# EAGLE design gps-power (EAGLE 9.6.2)
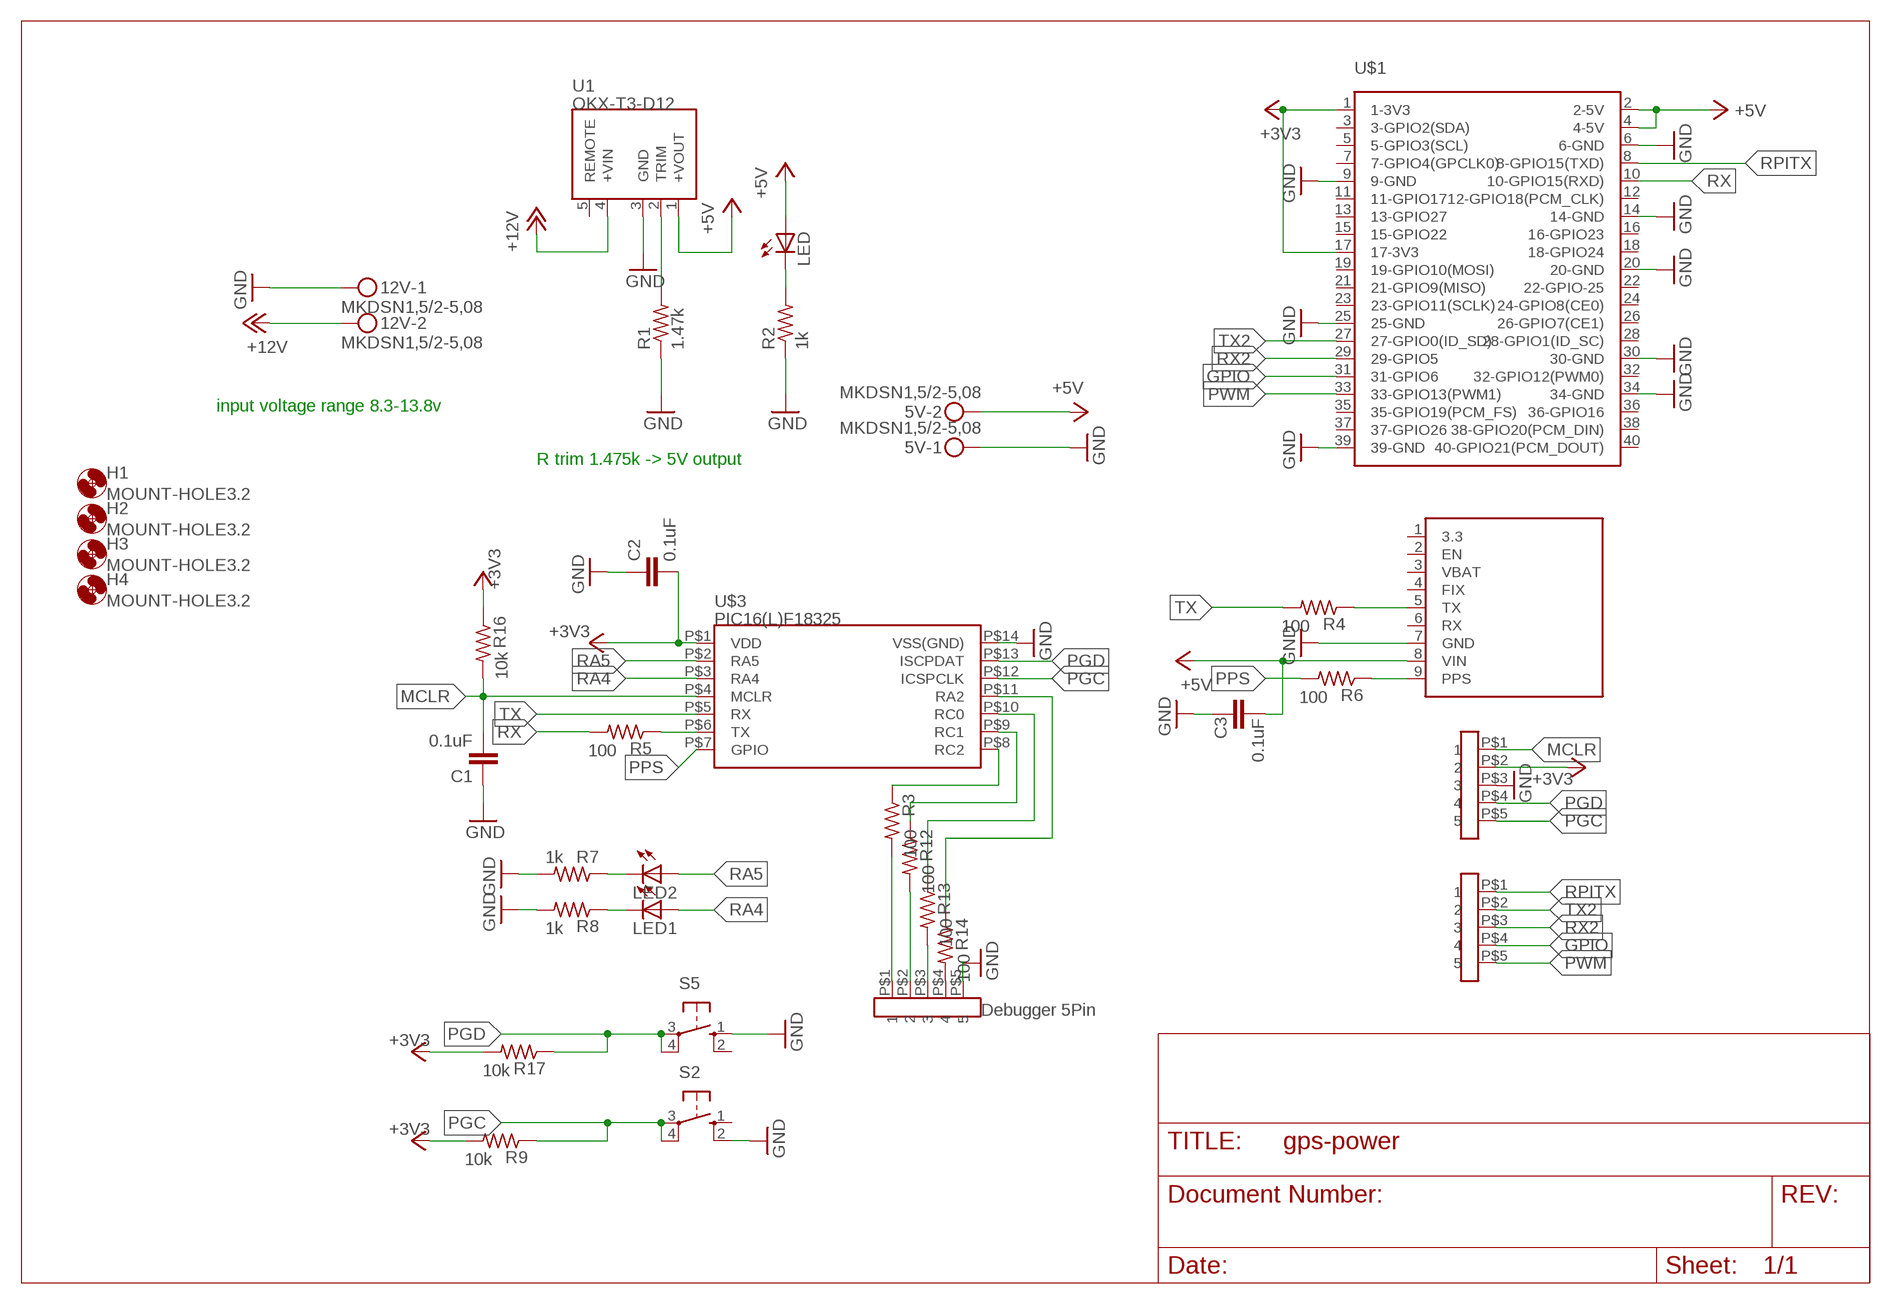
[diagram p0: schematic, sheet 1]

## Parts
5V  MKDSN1,5/2-5,08  [MKDSN1,5/2-5,08]
8,9,10,11,GND  PIN-5  [PIN-5]
12V  MKDSN1,5/2-5,08  [MKDSN1,5/2-5,08]
C1  0.1uF  0.1UF-0603-25V-5%  [0603]
C2  0.1uF  0.1UF-0603-25V-5%  [0603]
C3  0.1uF  0.1UF-0603-25V-5%  [0603]
GND  PIN-5  [PIN-5]
H1  MOUNT-HOLE3.2  [3,2]
H2  MOUNT-HOLE3.2  [3,2]
H3  MOUNT-HOLE3.2  [3,2]
H4  MOUNT-HOLE3.2  [3,2]
LED  LEDCHIPLED_0603  [CHIPLED_0603]
LED1  LEDCHIPLED_0603  [CHIPLED_0603]
LED2  LEDCHIPLED_0603  [CHIPLED_0603]
MPLAB  PIN-5  [PIN-5]
R1  1.47k  R-US_R0603  [R0603]
R2  1k  R-US_R0603  [R0603]
R3  100  R-US_R0603  [R0603]
R4  100  R-US_R0603  [R0603]
R5  100  R-US_R0603  [R0603]
R6  100  R-US_R0603  [R0603]
R7  1k  R-US_R0603  [R0603]
R8  1k  R-US_R0603  [R0603]
R9  10k  R-US_R0603  [R0603]
R12  100  R-US_R0603  [R0603]
R13  100  R-US_R0603  [R0603]
R14  100  R-US_R0603  [R0603]
R16  10k  R-US_R0603  [R0603]
R17  10k  R-US_R0603  [R0603]
S2  10-XX  [B3F-10XX]
S5  10-XX  [B3F-10XX]
U1  OKX-T3-D12  [OKX-T3-D12]
U$1  GPIO-HD-2X20  [GPIO-HD-2X20]
U$2  ADA-GPS  [ADA-GPS]
U$3  PIC16(L)F18325  [DIP-S-14]

## Nets
+3V3: C2.2 MPLAB.P$2 R9.2 R16.1 R17.2 U$1.1(1-3V3) U$1.17(17-3V3) U$3.P$1(VDD)
+5V: 5V.2 C3.2 LED.A U1.1(+VOUT) U$1.2(2-5V) U$1.4(4-5V) U$2.8(VIN)
+12V: 12V.2 U1.4(+VIN)
GND: 5V.1 8,9,10,11,GND.P$5 12V.1 C1.1 C2.1 C3.1 MPLAB.P$3 R1.1 R2.1 R7.2 R8.2 S2.2(S1) S5.1(S) U1.3(GND) U$1.6(6-GND) U$1.9(9-GND) U$1.14(14-GND) U$1.20(20-GND) U$1.25(25-GND) U$1.30(30-GND) U$1.34(34-GND) U$1.39(39-GND) U$2.7(GND) U$3.P$14(VSS(GND))
GPIO: GND.P$4 U$1.31(31-GPIO6)
MCLR: C1.2 MPLAB.P$1 R16.2 U$3.P$4(MCLR)
N$1: 8,9,10,11,GND.P$4 R14.2
N$2: R5.1 U$3.P$6(TX)
N$3: LED.C R2.2
N$4: LED2.C R7.1
N$5: R3.1 U$3.P$8(RC2)
N$6: R6.1 U$2.9(PPS)
N$7: R12.1 U$3.P$9(RC1)
N$8: R4.1 U$2.5(TX)
N$10: LED1.C R8.1
N$11: R13.1 U$3.P$10(RC0)
N$12: R14.1 U$3.P$11(RA2)
N$13: 8,9,10,11,GND.P$1 R3.2
N$16: 8,9,10,11,GND.P$2 R12.2
N$17: 8,9,10,11,GND.P$3 R13.2
PGC: MPLAB.P$5 R9.1 S2.3(P) S2.4(P1) U$3.P$12(ICSPCLK)
PGD: MPLAB.P$4 R17.1 S5.3(P) S5.4(P1) U$3.P$13(ISCPDAT)
PPS: R6.2 U$3.P$7(GPIO)
PWM: GND.P$5 U$1.33(33-GPIO13(PWM1))
RA4: LED1.A U$3.P$3(RA4)
RA5: LED2.A U$3.P$2(RA5)
RPITX: GND.P$1 U$1.8(8-GPIO15(TXD))
RX: R5.2 U$1.10(10-GPIO15(RXD))
RX2: GND.P$3 U$1.29(29-GPIO5)
TRIM: R1.2 U1.2(TRIM)
TX: R4.2 U$3.P$5(RX)
TX2: GND.P$2 U$1.27(27-GPIO0(ID_SD))
Unconnected: S2.1(S) S5.2(S1) U1.5(REMOTE) U$1.3(3-GPIO2(SDA)) U$1.5(5-GPIO3(SCL)) U$1.7(7-GPIO4(GPCLK0)) U$1.11(11-GPIO17) U$1.12(12-GPIO18(PCM_CLK)) U$1.13(13-GPIO27) U$1.15(15-GPIO22) U$1.16(16-GPIO23) U$1.18(18-GPIO24) U$1.19(19-GPIO10(MOSI)) U$1.21(21-GPIO9(MISO)) U$1.22(22-GPIO-25) U$1.23(23-GPIO11(SCLK)) U$1.24(24-GPIO8(CE0)) U$1.26(26-GPIO7(CE1)) U$1.28(28-GPIO1(ID_SC)) U$1.32(32-GPIO12(PWM0)) U$1.35(35-GPIO19(PCM_FS)) U$1.36(36-GPIO16) U$1.37(37-GPIO26) U$1.38(38-GPIO20(PCM_DIN)) U$1.40(40-GPIO21(PCM_DOUT)) U$2.1(3.3) U$2.2(EN) U$2.3(VBAT) U$2.4(FIX) U$2.6(RX)

## Notes on the sheet
- input voltage range 8.3-13.8v
- R trim 1.475k -> 5V output
- Debugger 5Pin

## Library data of the parts
5V 12V = con-phoenix-508:MKDSN1,5/2-5,08: MKDSN 1,5/ 2-5,08 Printklemme Nennstrom: 13,5 A Nennspannung: 250 V Rastermaß: 5,08 mm Polzahl: 2 Anschlussart: Schraubanschluss Montage: Löten Anschlussrichtung Leiter/Platine: 0 ° Artikelnummer: 1729128 Source: http://eshop.phoenixcontact.com .. 1729128.pdf
8,9,10,11,GND GND MPLAB = GPS-power:PIN-5: Pin Header 1x5 2.54mm(1in)
C1-C3 = SparkFun-Capacitors:0.1UF: 0.1µF ceramic capacitors A capacitor is a passive two-terminal electrical component used to store electrical energy temporarily in an electric field.; PROD_ID: CAP-08604
H1-H4 = holes:MOUNT-HOLE: MOUNTING HOLE with drill center marker
LED LED1 LED2 = adafruit:LED: LED OSRAM: - CHIPLED LG R971, LG N971, LY N971, LG Q971, LY Q971, LO R971, LY R971 LH N974, LH R974 LS Q976, LO Q976, LY Q976 LO Q996 - Hyper CHIPLED LW Q18S LB Q993, LB Q99A, LB R99A - SideLED LS A670, LO A670, LY A670, LG A670, LP A670 LB A673, LV A673, LT A673, LW A673 LH A674 LY A675 LS A676, LA A676, LO A676, LY A676, LW A676 LS A679, LY A679, LG A679 - Hyper Micro SIDELED® LS Y876, LA Y876, LO Y876, LY Y876 LT Y87S - SmartLED LW L88C, LW L88S LB L89C, LB L89S, LG L890 LS L89K, LO L89K, LY L89K LS L896, LA L896, LO L896, LY L896 - TOPLED LS T670, LO T670, LY T670, LG T670, LP T670 LSG T670, LSP T670, LSY T670, LOP T670, LYG T670 LG T671, LOG T671, LSG T671 LB T673, LV T673, LT T673, LW T673 LH T674 LS T676, LA T676, LO T676, LY T676, LB T676, LH T676, LSB T676, LW T676 LB T67C, LV T67C, LT T67C, LS T67K, LO T67K, LY T67K, LW E67C LS E67B, LA E67B, LO E67B, LY E67B, LB E67C, LV E67C, LT E67C LW T67C LS T679, LY T679, LG T679 LS T770, LO T770, LY T770, LG T770, LP T770 LB T773, LV T773, LT T773, LW T773 LH T774 LS E675, LA E675, LY E675, LS T675 LS T776, LA T776, LO T776, LY T776, LB T776 LHGB T686 LT T68C, LB T68C - Hyper Mini TOPLED® LB M676 - Mini TOPLED Santana® LG M470 LS M47K, LO M47K, LY M47K Source: http://www.osram.convergy.de/
R1-R9 R12-R14 R16 R17 = rcl:R-US_: RESISTOR, American symbol; SPICEPREFIX: R
S2 S5 = switch-omron:10-XX: OMRON SWITCH; MPN: B3F-1000; OC_FARNELL: 176432; OC_NEWARK: 36M3542
U1 = suhyouri:OKX-T3-D12: Murata OKX-T/3-D12N-C Adjustable 3-Amp SIP Non-Isolated DC/DC Converters https://www.digikey.kr/product-detail/ko/murata-power-solutions-inc/OKX-T-3-D12N-C/811-2623-ND/3314278
U$1 = suhyouri:GPIO-HD-2X20: GPIO Header for RaspberryPi A+/B+/Pi 2/Pi 3 - Tall 2x20 Female Header https://www.adafruit.com/product/1992
U$2 = GPS-power:ADA-GPS: Adafruit Ultimate GPS Breakout - 66 channel w/10 Hz updates - Version 3 https://www.adafruit.com/product/746
U$3 = GPS-power:PIC16(L)F18325: PIC16(L)F18325

## Board
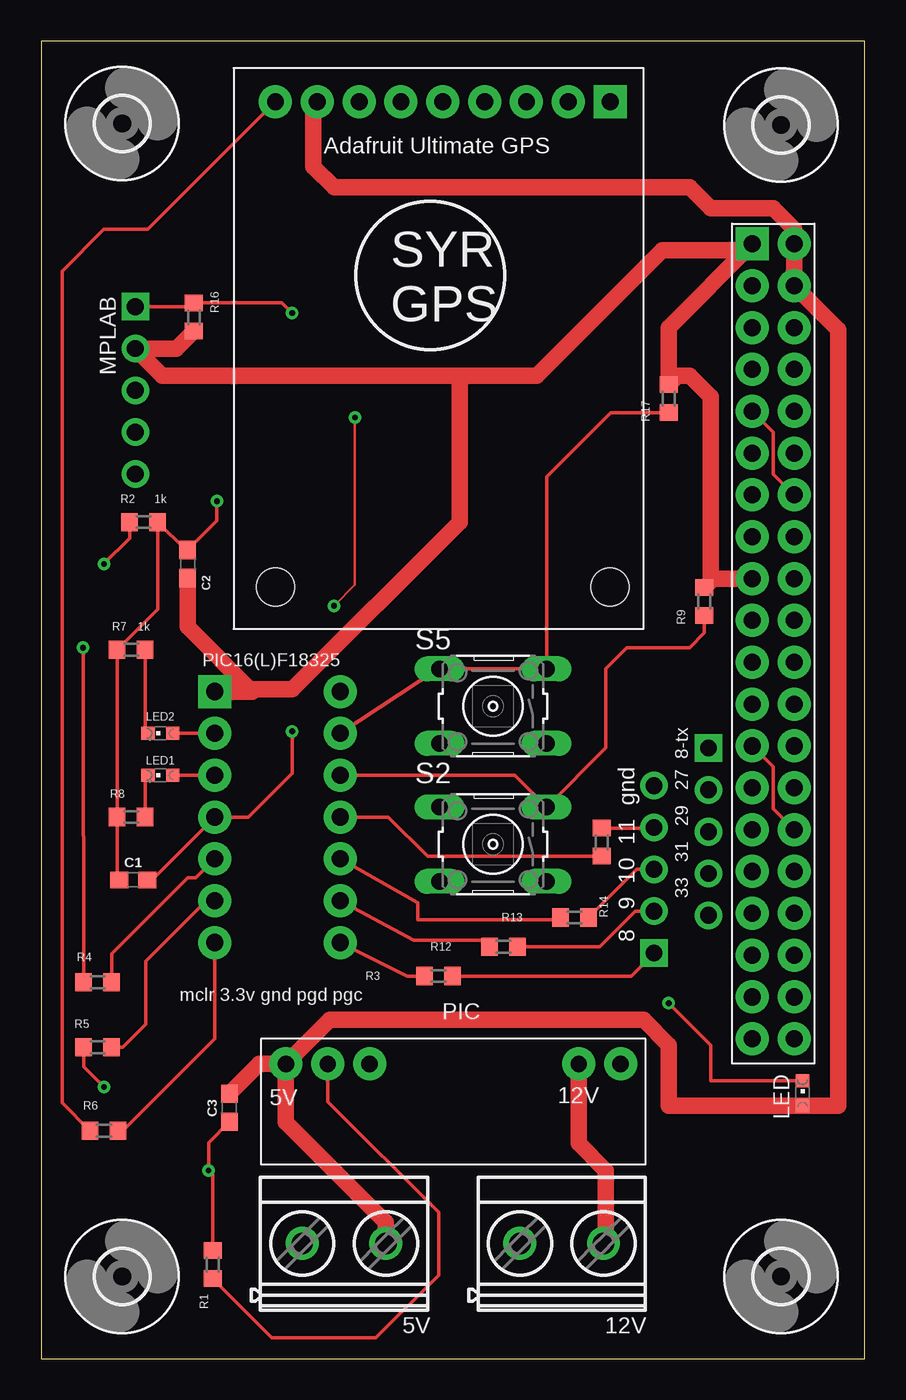
[diagram p1: board, top side]
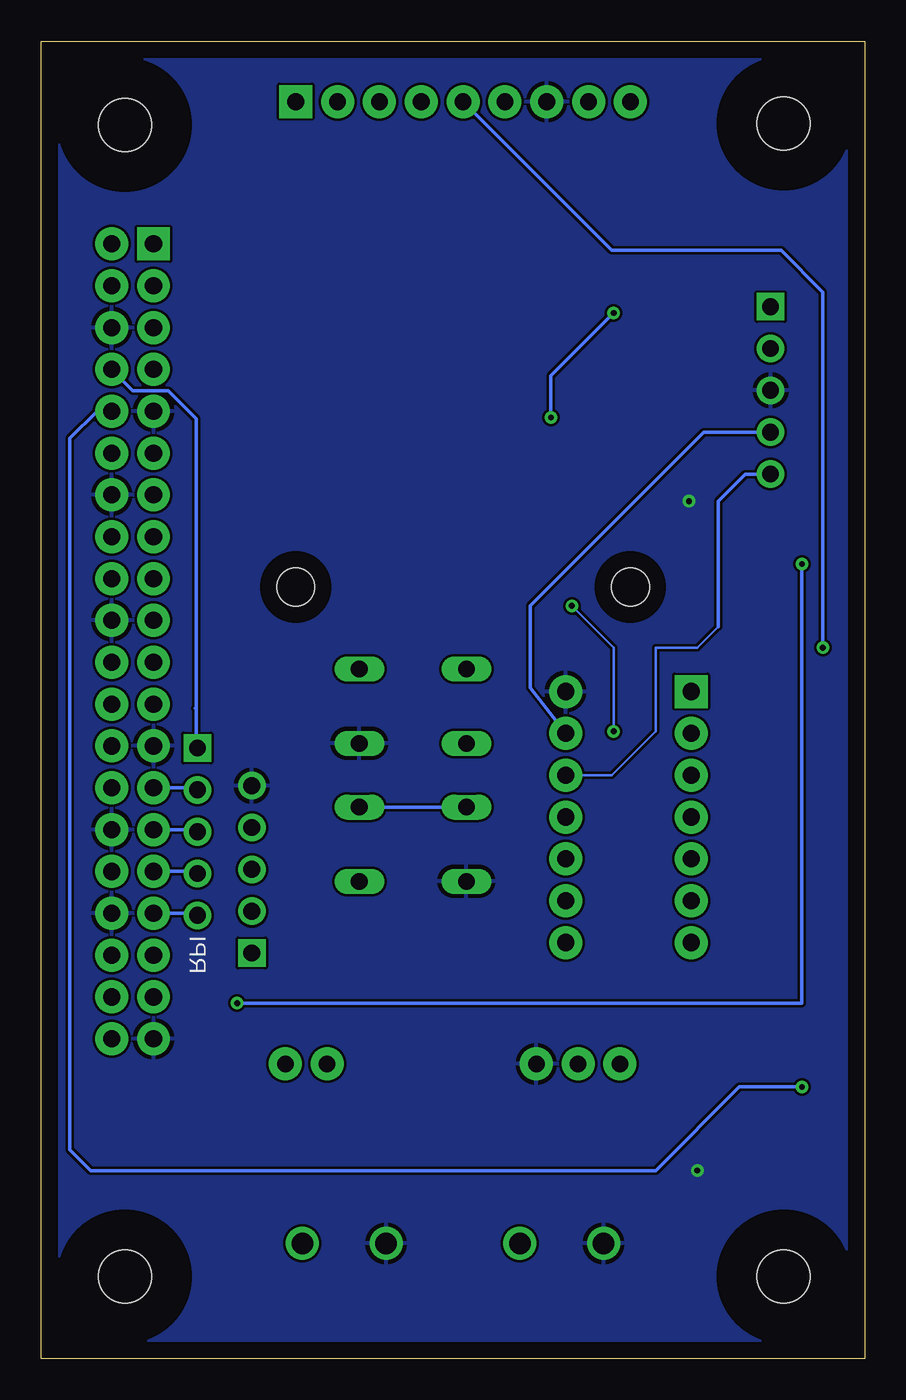
[diagram p2: board, bottom side, seen from below]

Size 50 x 80 mm. Coordinates in mm from the lower left corner, seen from the top.
Outline: 0,0 50,0 50,80 0,80 0,0
Copper layers (1*16): Top 0.035mm / dielectric 1.5mm / Bottom 0.035mm
Design rules "default": minimum track width 6mil, minimum drill 0.35mm, track to track 6mil, track to pad 6mil, pad to pad 6mil, via to via 6mil, smd to smd 6mil, copper to edge 40mil, drill to drill 6mil, minimum pad ring 10mil, minimum via ring 8mil, stop-mask expansion 4mil, vias tented up to drill 0mil, thermal gap 10mil

### Footprints (pad centres in the part's own frame; a part is rotated, then mirrored left to right if it is on the bottom)
MKDSN1,5/2-5,08 = drill 1.3 pad 2: 1 -2.561,0.025; 2 2.519,0.025
PIN-5 = drill 1.02 pad 1.676 square: P$1 0,0 | drill 1.02 pad 1.676: P$2 0,-2.54; P$3 0,-5.08; P$4 0,-7.62; P$5 0,-10.16
0603 = smd 1.1 x 1: 1 -0.85,0; 2 0.85,0
3,2 = hole 3.2: 0,0
CHIPLED_0603 = smd 0.8 x 0.8: A 0,-0.75; C 0,0.75
R0603 = smd 1 x 1.1: 1 -0.85,0; 2 0.85,0
B3F-10XX = drill 1.016 long: 1 -3.251,2.261; 2 3.251,2.261; 3 -3.251,-2.261; 4 3.251,-2.261
OKX-T3-D12 = drill 1 pad 2: 1 17.78,0; 2 15.24,0; 3 12.7,0; 4 0,0; 5 -2.54,0
GPIO-HD-2X20 = drill 1.04 pad 2 square: 1 0,0 | drill 1.04 pad 2: 2 2.54,0; 3 0,-2.54; 4 2.54,-2.54; 5 0,-5.08; 6 2.54,-5.08; 7 0,-7.62; 8 2.54,-7.62; 9 0,-10.16; 10 2.54,-10.16; 11 0,-12.7; 12 2.54,-12.7; 13 0,-15.24; 14 2.54,-15.24; 15 0,-17.78; 16 2.54,-17.78; 17 0,-20.32; 18 2.54,-20.32; 19 0,-22.86; 20 2.54,-22.86; 21 0,-25.4; 22 2.54,-25.4; 23 0,-27.94; 24 2.54,-27.94; 25 0,-30.48; 26 2.54,-30.48; 27 0,-33.02; 28 2.54,-33.02; 29 0,-35.56; 30 2.54,-35.56; 31 0,-38.1; 32 2.54,-38.1; 33 0,-40.64; 34 2.54,-40.64; 35 0,-43.18; 36 2.54,-43.18; 37 0,-45.72; 38 2.54,-45.72; 39 0,-48.26; 40 2.54,-48.26
ADA-GPS = drill 1.02 pad 2 square: 1 0,0 | drill 1.02 pad 2: 2 0,-2.54; 3 0,-5.08; 4 0,-7.62; 5 0,-10.16; 6 0,-12.7; 7 0,-15.24; 8 0,-17.78; 9 0,-20.32 | hole 2.286: 29.464,0; 29.464,-20.32
DIP-S-14 = drill 1.04 pad 2 square: P$1 0,15.24 | drill 1.04 pad 2: P$2 0,12.7; P$3 0,10.16; P$4 0,7.62; P$5 0,5.08; P$6 0,2.54; P$7 0,0; P$8 7.62,0; P$9 7.62,2.54; P$10 7.62,5.08; P$11 7.62,7.62; P$12 7.62,10.16; P$13 7.62,12.7; P$14 7.62,15.24

### Placement (x,y rotation side)
5V  18.41,6.99 0 top
8,9,10,11,GND  37.21,24.64 180 top
12V  31.62,6.99 0 top
C1  5.59,29.08 0 top
C2  8.89,48.26 270 top
C3  11.43,15.24 90 top
GND  40.51,37.08 0 top
H1  4.92,75 0 top
H2  4.92,5 0 top
H3  44.92,5 0 top
H4  44.92,74.92 0 top
LED  46.23,16.13 0 top
LED1  7.24,35.43 90 top
LED2  7.24,37.97 90 top
MPLAB  5.71,63.88 0 top
R1  10.41,5.71 270 top
R2  6.22,50.8 180 top
R3  24.13,23.24 0 top
R4  3.43,22.86 0 top
R5  3.43,18.92 180 top
R6  3.81,13.84 0 top
R7  5.46,43.05 180 top
R8  5.46,32.89 180 top
R9  40.26,45.97 90 top
R12  28.07,25.02 0 top
R13  32.38,26.8 0 top
R14  34.04,31.37 90 top
R16  9.27,63.25 90 top
R17  38.1,58.29 90 top
S2  27.43,31.24 180 top
S5  27.43,39.62 180 top
U1  32.64,17.91 180 top
U$1  43.18,67.69 0 top
U$2  34.54,76.33 270 top
U$3  10.54,25.27 0 top

### Tracks (layer width: path | path; a pad name or v marks a point on that pad's centre or on a via)
+3V3
  Top 1: 25.4,59.69 30.1,59.69 37.72,67.31 42.8,67.31 U$1.1 38.1,62.61 R17.2 38.65,59.69 39.37,59.69 40.64,58.42 40.64,47.54 40.81,47.37 | 25.4,59.69 25.4,50.8 15.24,40.64 10.67,40.64 U$3.P$1 12.83,40.51 8.89,44.45 C2.2 | R16.1 8.22,61.34 MPLAB.P$2 7.37,59.69 25.4,59.69 | R9.2 40.81,47.37 | 40.81,47.37 U$1.17
+5V
  Top 1: U1.1 14.86,14.35 20.93,8.28 5V.2 | U1.1 17.53,20.57 36.58,20.57 38.1,19.05 38.1,15.38 LED.A 48.4,15.38 48.4,62.47 U$1.4 U$1.2 45.72,68.58 44.45,69.85 40.64,69.85 39.37,71.12 17.78,71.12 16.51,72.39 16.51,76.07 U$2.8 | U1.1 13.25,17.91 C3.2
+12V
  Top 1: U1.4 32.64,13.08 34.29,11.43 34.29,7.16 12V.2
GND  (via drill 0.35)
  Top 0.2: R2.1 7.11,50.84 | R2.1 8.76,49.11 C2.1 10.67,50.89 v10.67,52.07 | R2.1 7.07,45.52 R7.2 R8.2 4.61,29.21 C1.1 | R1.1 10.41,11.18 v10.16,11.43 10.16,13.12 C3.1 | U$1.14 44.45,53.72 44.45,56.26 U$1.9 | U$1.25 44.45,35.94 44.45,33.4 U$1.30
  pour Bottom: 2.54,82.55 -3.81,76.2 -3.81,3.81 3.81,-3.81 5.08,-3.81 46.99,-3.81 53.34,2.54 53.34,77.47 48.26,82.55 46.99,83.82 3.81,83.82
GPIO
  Bottom 0.2: GND.P$4 40.64,29.59 U$1.31
MCLR  (via drill 0.35)
  Top 0.152: v17.78,45.72 19.05,46.99 v19.05,57.15
  Top 0.2: C1.2 6.73,29.08 U$3.P$4 12.57,32.89 15.24,35.56 v15.24,38.1 | MPLAB.P$1 9.06,63.88 R16.2 9.31,64.13 14.61,64.13 v15.24,63.5
  Bottom 0.152: v15.24,38.1 15.24,43.18 v17.78,45.72
  Bottom 0.2: v15.24,63.5 19.05,59.69 v19.05,57.15
N$1
  Top 0.2: R14.2 37.17,32.22 8,9,10,11,GND.P$4
N$2
  Top 0.2: U$3.P$6 10.03,27.81 6.35,24.13 6.35,20.32 4.95,18.92 R5.1
N$3  (via drill 0.35)
  Top 0.2: R2.2 5.37,49.82 v3.81,48.26 | v38.1,21.59 40.64,19.05 40.64,16.88 LED.C
  Bottom 0.2: v3.81,48.26 3.81,21.59 v38.1,21.59
N$4
  Top 0.2: R7.1 6.31,38.15 LED2.C
N$5
  Top 0.2: U$3.P$8 22.23,23.24 R3.1
N$6
  Top 0.2: R6.1 1.27,15.53 1.27,66.04 3.81,68.58 6.48,68.58 U$2.9
N$7
  Top 0.2: U$3.P$9 22.61,25.4 26.84,25.4 R12.1
N$8  (via drill 0.35)
  Top 0.2: R4.1 2.58,31.71 2.54,31.75 v2.54,43.18
  Bottom 0.2: v2.54,43.18 2.54,64.77 5.08,67.31 15.37,67.31 U$2.5
N$10
  Top 0.2: R8.1 6.31,35.26 LED1.C
N$11
  Top 0.2: U$3.P$10 22.86,27.69 22.86,26.67 31.41,26.67 R13.1
N$12
  Top 0.2: U$3.P$11 21.08,32.89 23.46,30.52 R14.1
N$13
  Top 0.2: R3.2 35.81,23.24 8,9,10,11,GND.P$1
N$16
  Top 0.2: R12.2 33.91,25.02 36.07,27.18 8,9,10,11,GND.P$2
N$17
  Top 0.2: R13.2 36.16,29.72 8,9,10,11,GND.P$3
PGC
  Top 0.2: U$3.P$12 28.75,35.43 S2.3 | S2.3 30.96,33.5 | R9.1 40.26,44.07 39.37,43.18 35.56,43.18 34.29,41.91 34.29,37.11 S2.3
  Bottom 0.152: 8.89,44.45 10.16,43.18 12.7,43.18 12.7,38.1 15.37,35.43 17.91,35.43
  Bottom 0.2: S2.4 S2.3 | MPLAB.P$5 7.24,53.72 8.89,52.07 8.89,44.45 | 17.91,35.43 U$3.P$12
PGD
  Top 0.2: U$3.P$13 24.11,41.88 S5.4 S5.3 30.68,53.54 34.58,57.44 R17.1
  Bottom 0.2: U$3.P$13 20.32,40.75 20.32,45.72 9.78,56.26 MPLAB.P$4
PPS
  Top 0.2: R6.2 4.79,13.97 5.08,13.97 10.54,19.43 U$3.P$7
PWM
  Bottom 0.2: GND.P$5 40.64,27.05 U$1.33
RA4
  Top 0.2: U$3.P$3 LED1.A
RA5
  Top 0.2: LED2.A U$3.P$2
RPITX
  Bottom 0.2: GND.P$1 40.58,37.15 40.58,39.43 | 40.64,39.5 40.58,39.43 | 40.58,39.43 40.58,57.09 42.27,58.78 44.43,58.78 U$1.8
RX  (via drill 0.35)
  Top 0.2: R5.2 2.58,17.74 v3.81,16.51
  Bottom 0.2: U$1.10 46.61,57.53 48.26,55.88 48.26,12.7 46.99,11.43 12.7,11.43 7.62,16.51 v3.81,16.51
RX2
  Bottom 0.2: GND.P$3 40.64,32.13 U$1.29
TRIM
  Top 0.2: U1.2 17.4,15.62 24.13,8.89 24.13,5.08 20.32,1.27 14.01,1.27 R1.2
TX
  Top 0.2: U$3.P$5 9.4,29.21 8.89,29.21 4.28,24.6 R4.2
TX2
  Bottom 0.2: GND.P$2 40.64,34.67 U$1.27

### Text on the board
tPlace: Adafruit Ultimate GPS | SYR / GPS | 1k | 1k | 33 31 29 27 8-tx | 8 9 10 11 gnd | mclr 3.3v gnd pgd pgc | PIC | 5V | 12V
bPlace: RPI